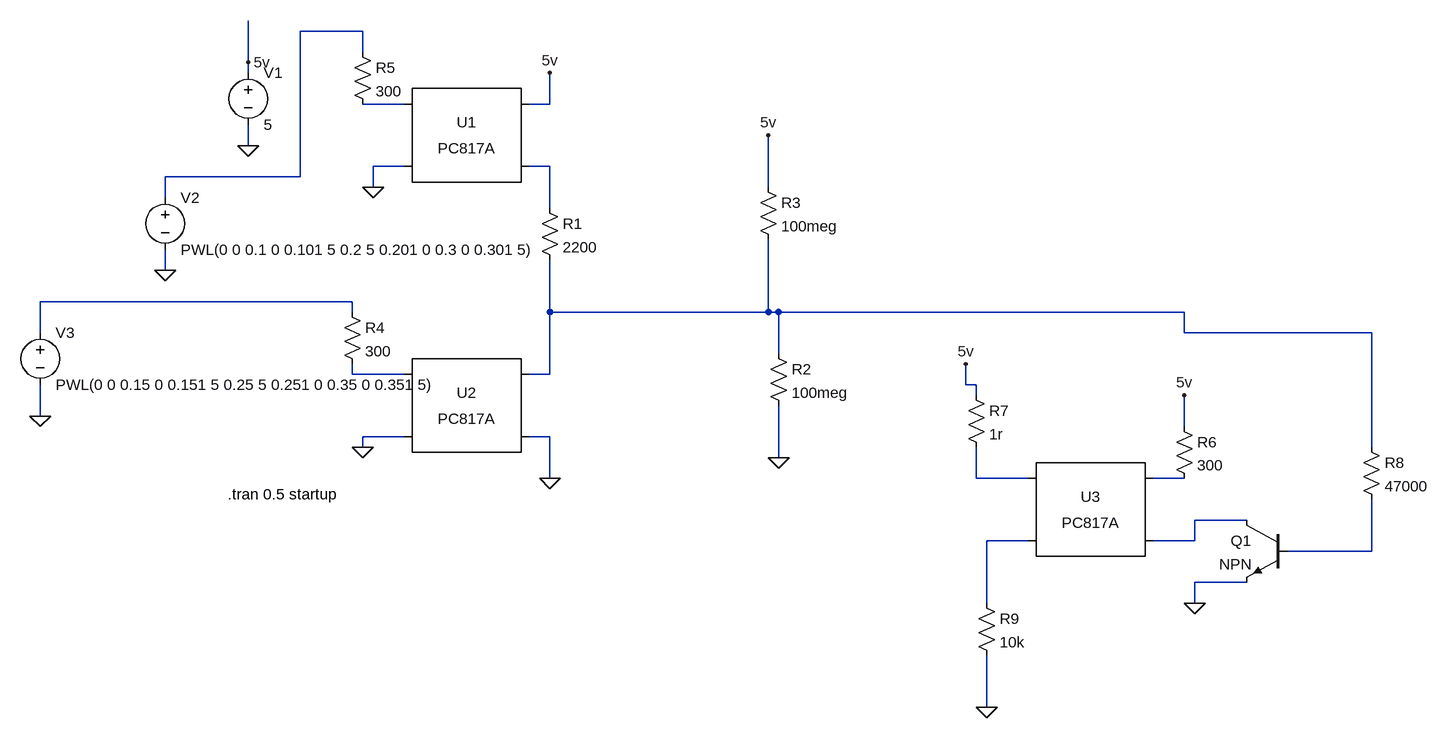
[diagram p0: schematic optoHott.asc]
optoHott.asc, the LTspice schematic file:
Version 4
SHEET 1 1600 820
WIRE -48 -240 -144 -240
WIRE -48 -208 -48 -240
WIRE -224 -192 -224 -256
WIRE -224 -176 -224 -192
WIRE 16 -128 -48 -128
WIRE 240 -128 240 -176
WIRE 240 -128 208 -128
WIRE -224 -64 -224 -96
WIRE 16 -32 -32 -32
WIRE 240 -32 208 -32
WIRE -144 -16 -144 -240
WIRE -144 -16 -352 -16
WIRE -32 0 -32 -32
WIRE 576 0 576 -80
WIRE -352 16 -352 -16
WIRE 240 32 240 -32
WIRE -352 128 -352 96
WIRE -64 176 -544 176
WIRE -64 192 -64 176
WIRE 240 192 240 112
WIRE 576 192 576 80
WIRE 576 192 240 192
WIRE 592 192 576 192
WIRE 1216 192 592 192
WIRE -544 224 -544 176
WIRE 1216 224 1216 192
WIRE 1504 224 1216 224
WIRE 592 256 592 192
WIRE -64 288 -64 272
WIRE 16 288 -64 288
WIRE 240 288 240 192
WIRE 240 288 208 288
WIRE 880 304 880 272
WIRE 896 304 880 304
WIRE 896 320 896 304
WIRE -544 352 -544 304
WIRE 1216 368 1216 320
WIRE 16 384 -48 384
WIRE 240 384 208 384
WIRE -48 400 -48 384
WIRE 1504 400 1504 224
WIRE 592 416 592 336
WIRE 240 448 240 384
WIRE 896 448 896 400
WIRE 976 448 896 448
WIRE 1216 448 1168 448
WIRE 1312 512 1232 512
WIRE 976 544 912 544
WIRE 1232 544 1232 512
WIRE 1232 544 1168 544
WIRE 1504 560 1504 480
WIRE 1504 560 1376 560
WIRE 1312 608 1232 608
WIRE 912 640 912 544
WIRE 1232 640 1232 608
WIRE 912 800 912 720
FLAG 240 448 0
FLAG 240 -176 5v
FLAG -224 -192 5v
FLAG -224 -64 0
FLAG -352 128 0
FLAG -544 352 0
FLAG 592 416 0
FLAG 576 -80 5v
FLAG -32 0 0
FLAG -48 400 0
FLAG 1232 640 0
FLAG 912 800 0
FLAG 880 272 5v
FLAG 1216 320 5v
SYMBOL res 224 16 R0
SYMATTR InstName R1
SYMATTR Value 2200
SYMBOL voltage -224 -192 R0
WINDOW 123 0 0 Left 0
WINDOW 39 0 0 Left 0
SYMATTR InstName V1
SYMATTR Value 5
SYMBOL voltage -352 0 R0
WINDOW 123 0 0 Left 0
WINDOW 39 0 0 Left 0
SYMATTR InstName V2
SYMATTR Value PWL(0 0 0.1 0 0.101 5 0.2 5 0.201 0 0.3 0 0.301 5)
SYMBOL voltage -544 208 R0
WINDOW 123 0 0 Left 0
WINDOW 39 0 0 Left 0
SYMATTR InstName V3
SYMATTR Value PWL(0 0 0.15 0 0.151 5 0.25 5 0.251 0 0.35 0 0.351 5)
SYMBOL res 576 240 R0
SYMATTR InstName R2
SYMATTR Value 100meg
SYMBOL res 560 -16 R0
SYMATTR InstName R3
SYMATTR Value 100meg
SYMBOL Optos\\PC817A 112 -80 R0
SYMATTR InstName U1
SYMBOL Optos\\PC817A 112 336 R0
SYMATTR InstName U2
SYMBOL Optos\\PC817A 1072 496 M0
SYMATTR InstName U3
SYMBOL res -80 176 R0
SYMATTR InstName R4
SYMATTR Value 300
SYMBOL res -64 -224 R0
SYMATTR InstName R5
SYMATTR Value 300
SYMBOL res 1200 352 R0
SYMATTR InstName R6
SYMATTR Value 300
SYMBOL res 880 304 R0
SYMATTR InstName R7
SYMATTR Value 1r
SYMBOL npn 1376 512 M0
SYMATTR InstName Q1
SYMBOL res 1488 384 R0
SYMATTR InstName R8
SYMATTR Value 47000
SYMBOL res 896 624 R0
SYMATTR InstName R9
SYMATTR Value 10k
TEXT -256 472 Left 0 !.tran 0.5 startup

The netlist it stands for:
* optoHott.asc
R1 N003 N005 2200
V1 5v 0 5
V2 N001 0 PWL(0 0 0.1 0 0.101 5 0.2 5 0.201 0 0.3 0 0.301 5)
V3 N004 0 PWL(0 0 0.15 0 0.151 5 0.25 5 0.251 0 0.35 0 0.351 5)
R2 N005 0 100meg
R3 5v N005 100meg
XU1 N002 0 5v N003 PC817 Igain=1m
XU2 N006 0 N005 0 PC817 Igain=1m
XU3 N008 N009 N007 N010 PC817 Igain=1m
R4 N004 N006 300
R5 N001 N002 300
R6 5v N008 300
R7 5v N007 1r
Q1 N009 N011 0 0 NPN
R8 N005 N011 47000
R9 N010 0 10k
.model NPN NPN
.model PNP PNP
.lib standard.bjt
.tran 0.5 startup
.lib PC817.sub
.backanno
.end